# EAGLE schematic Motherboard (EAGLE 9.4.2)
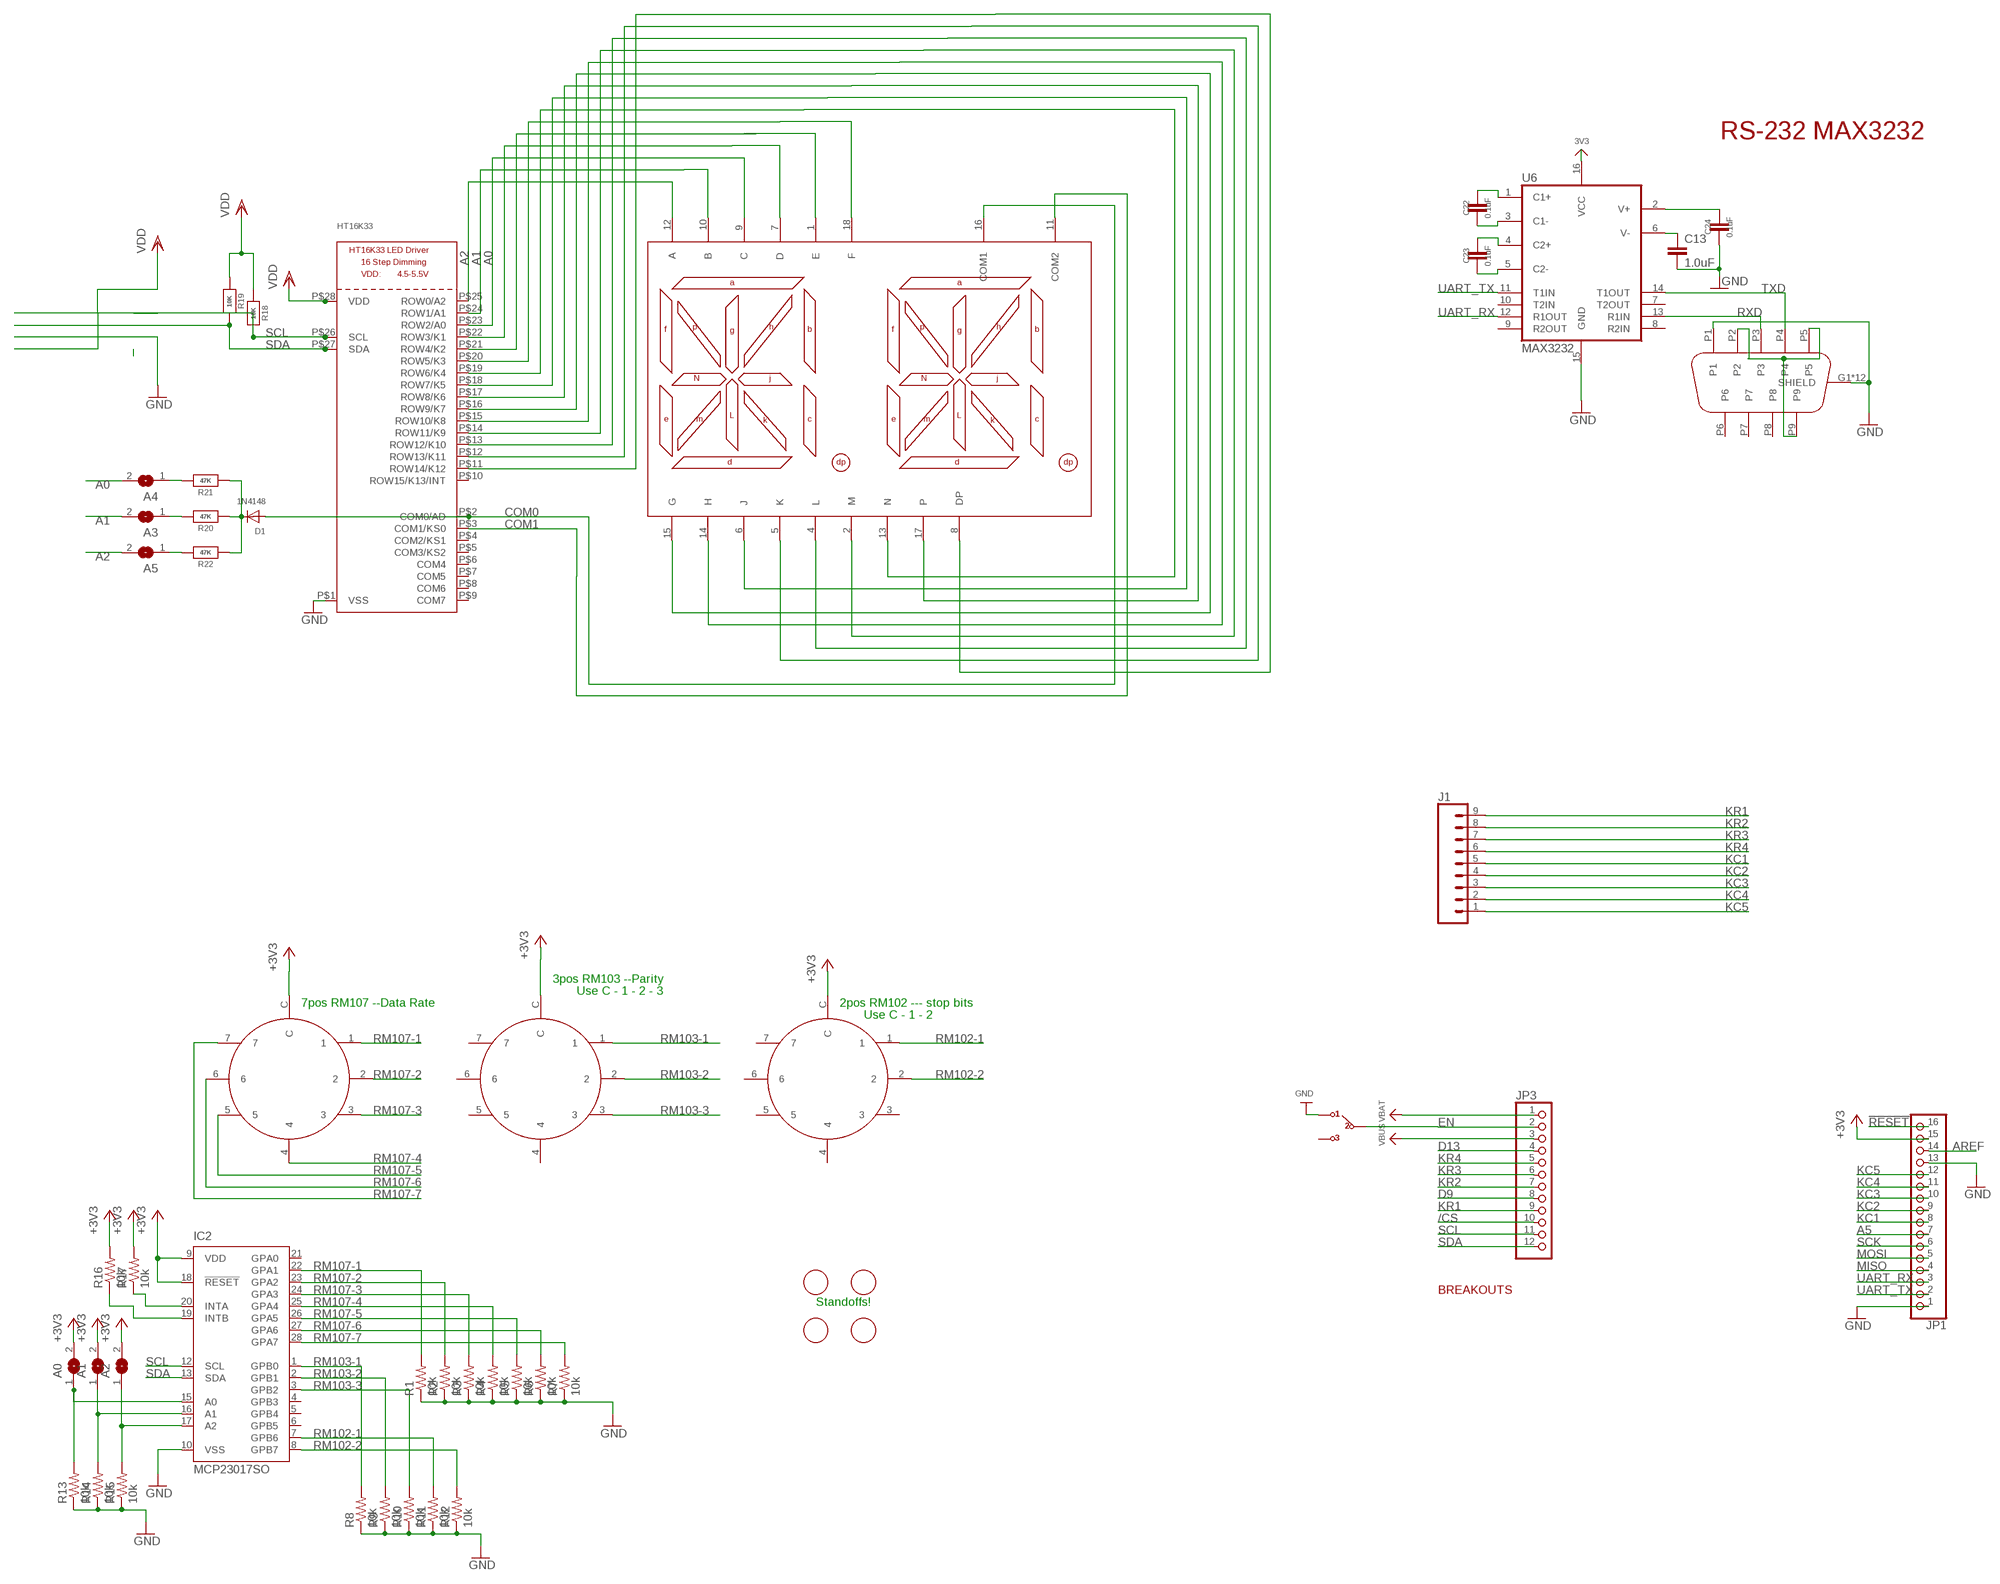
[diagram p0: schematic, sheet 1]

## Parts
A0  SJ  [SJ]
A1  SJ  [SJ]
A2  SJ  [SJ]
A3  SOLDERJUMPERREFLOW_NOPASTE  [SOLDERJUMPER_REFLOW_NOPASTE]
A4  SOLDERJUMPERREFLOW_NOPASTE  [SOLDERJUMPER_REFLOW_NOPASTE]
A5  SOLDERJUMPERREFLOW_NOPASTE  [SOLDERJUMPER_REFLOW_NOPASTE]
C13  1.0uF  1.0UF-0805-25V-10%  [0805]
C22  0.1uF  1.0UF-0805-25V-10%  [0805]
C23  0.1uF  1.0UF-0805-25V-10%  [0805]
C24  0.1uF  1.0UF-0805-25V-10%  [0805]
D1  1N4148  DIODESOD-323F  [SOD-323F]
DE9FEMALE  EDGEMOUNTDE9  [DE09S065TLF]
HT16K33  HT16K33_SOP28_SKINNY  [SOP28_300MIL_SKINNY]
IC2  MCP23017SO  [SO28W]
J1  CONN_09  [1X09]
JP1  HEADER-1X16ROUND  [1X16_ROUND]
JP3  HEADER-1X12  [1X12_ROUND]
R1  10k  R-US_M0805  [M0805]
R2  10k  R-US_M0805  [M0805]
R3  10k  R-US_M0805  [M0805]
R4  10k  R-US_M0805  [M0805]
R5  10k  R-US_M0805  [M0805]
R6  10k  R-US_M0805  [M0805]
R7  10k  R-US_M0805  [M0805]
R8  10k  R-US_M0805  [M0805]
R9  10k  R-US_M0805  [M0805]
R10  10k  R-US_M0805  [M0805]
R11  10k  R-US_M0805  [M0805]
R12  10k  R-US_M0805  [M0805]
R13  10k  R-US_M0805  [M0805]
R14  10k  R-US_M0805  [M0805]
R15  10k  R-US_M0805  [M0805]
R16  10k  R-US_M0805  [M0805]
R17  10k  R-US_M0805  [M0805]
R18  10K  RESISTOR0805_NOOUTLINE  [0805-NO]
R19  10K  RESISTOR0805_NOOUTLINE  [0805-NO]
R20  47K  RESISTOR0805_NOOUTLINE  [0805-NO]
R21  47K  RESISTOR0805_NOOUTLINE  [0805-NO]
R22  47K  RESISTOR0805_NOOUTLINE  [0805-NO]
U6  MAX3232  MAX2323SOIC16  [SO16]
U$1  HDSP-A27C  [DIP-18]
U$2  RM107772BCB  [RM107772BCB]
U$3  RM107772BCB  [RM107772BCB]
U$5  OS102011MA1QN1  [OS102011MA1QN1]
U$6  RM107772BCB  [RM107772BCB]
U$7  KEYSTONESTANDOFF  [KEYSTONESTANDOFF]
U$8  KEYSTONESTANDOFF  [KEYSTONESTANDOFF]
U$9  KEYSTONESTANDOFF  [KEYSTONESTANDOFF]
U$10  KEYSTONESTANDOFF  [KEYSTONESTANDOFF]

## Nets
3V3: U6.16(VCC)
!RESET: JP1.16
+3V3: A0.2 A1.2 A2.2 IC2.9(VDD) IC2.18(!RESET) JP1.15 R16.2 R17.2 U$2.C U$3.C U$6.C
/CS: JP3.10
A0: A4.2 HT16K33.P$23(ROW2/A0) U$1.9(C)
A1: A3.2 HT16K33.P$24(ROW1/A1) U$1.10(B)
A2: A5.2 HT16K33.P$25(ROW0/A2) U$1.12(A)
A5: JP1.7
AREF: JP1.14
COM0: D1.A HT16K33.P$2(COM0/AD) U$1.16(COM1)
COM1: HT16K33.P$3(COM1/KS0) U$1.11(COM2)
D9: JP3.8
D13: JP3.4
EN: JP3.2 U$5.P$2
GND: C13.2 C24.2 DE9FEMALE.G1(SHIELD) DE9FEMALE.G2(SHIELD) DE9FEMALE.G3(SHIELD) DE9FEMALE.G4(SHIELD) DE9FEMALE.G5(SHIELD) DE9FEMALE.G6(SHIELD) DE9FEMALE.G7(SHIELD) DE9FEMALE.G8(SHIELD) DE9FEMALE.G9(SHIELD) DE9FEMALE.G10(SHIELD) DE9FEMALE.G11(SHIELD) DE9FEMALE.G12(SHIELD) DE9FEMALE.P1 HT16K33.P$1(VSS) IC2.10(VSS) JP1.1 JP1.13 R1.1 R2.1 R3.1 R4.1 R5.1 R6.1 R7.1 R8.1 R9.1 R10.1 R11.1 R12.1 R13.1 R14.1 R15.1 U6.15(GND) U$5.P$1
KC1: J1.5 JP1.8
KC2: J1.4 JP1.9
KC3: J1.3 JP1.10
KC4: J1.2 JP1.11
KC5: J1.1 JP1.12
KR1: J1.9 JP3.9
KR2: J1.8 JP3.7
KR3: J1.7 JP3.6
KR4: J1.6 JP3.5
MISO: JP1.4
MOSI: JP1.5
N$1: A3.1 R20.2
N$2: A4.1 R21.2
N$3: HT16K33.P$22(ROW3/K1) U$1.7(D)
N$4: HT16K33.P$21(ROW4/K2) U$1.1(E)
N$5: HT16K33.P$20(ROW5/K3) U$1.18(F)
N$6: HT16K33.P$19(ROW6/K4) U$1.13(N)
N$7: HT16K33.P$18(ROW7/K5) U$1.6(J)
N$8: D1.C R20.1 R21.1 R22.1
N$9: A5.1 R22.2
N$10: HT16K33.P$17(ROW8/K6) U$1.17(P)
N$11: HT16K33.P$16(ROW9/K7) U$1.15(G)
N$12: HT16K33.P$15(ROW10/K8) U$1.14(H)
N$18: C22.2 U6.3(C1-)
N$19: C22.1 U6.1(C1+)
N$20: C23.1 U6.4(C2+)
N$21: C23.2 U6.5(C2-)
N$22: C24.1 U6.2(V+)
N$23: C13.1 U6.6(V-)
N$24: DE9FEMALE.P2 DE9FEMALE.P5 DE9FEMALE.P9
N$25: A0.1 IC2.15(A0) R13.2
N$26: A1.1 IC2.16(A1) R14.2
N$27: A2.1 IC2.17(A2) R15.2
N$28: IC2.19(INTB) R16.1
N$29: IC2.20(INTA) R17.1
N$32: HT16K33.P$14(ROW11/K9) U$1.2(M)
N$33: HT16K33.P$13(ROW12/K10) U$1.4(L)
N$34: HT16K33.P$12(ROW13/K11) U$1.5(K)
N$35: HT16K33.P$11(ROW14/K12) U$1.8(DP)
RM102-1: IC2.7(GPB6) R11.2 U$6.1
RM102-2: IC2.8(GPB7) R12.2 U$6.2
RM103-1: IC2.1(GPB0) R8.2 U$3.1
RM103-2: IC2.2(GPB1) R9.2 U$3.2
RM103-3: IC2.3(GPB2) R10.2 U$3.3
RM107-1: IC2.22(GPA1) R1.2 U$2.1
RM107-2: IC2.23(GPA2) R2.2 U$2.2
RM107-3: IC2.24(GPA3) R3.2 U$2.3
RM107-4: IC2.25(GPA4) R4.2 U$2.4
RM107-5: IC2.26(GPA5) R5.2 U$2.5
RM107-6: IC2.27(GPA6) R6.2 U$2.6
RM107-7: IC2.28(GPA7) R7.2 U$2.7
RXD: DE9FEMALE.P3 U6.13(R1IN)
SCK: JP1.6
SCL: HT16K33.P$26(SCL) IC2.12(SCL) JP3.11 R18.2
SDA: HT16K33.P$27(SDA) IC2.13(SDA) JP3.12 R19.2
TXD: DE9FEMALE.P4 U6.14(T1OUT)
UART_RX: JP1.3 U6.12(R1OUT)
UART_TX: JP1.2 U6.11(T1IN)
VBAT: JP3.1
VBUS: JP3.3
VDD: HT16K33.P$28(VDD) R18.1 R19.1
Unconnected: DE9FEMALE.P6 DE9FEMALE.P7 DE9FEMALE.P8 HT16K33.P$4(COM2/KS1) HT16K33.P$5(COM3/KS2) HT16K33.P$6(COM4) HT16K33.P$7(COM5) HT16K33.P$8(COM6) HT16K33.P$9(COM7) HT16K33.P$10(ROW15/K13/INT) IC2.4(GPB3) IC2.5(GPB4) IC2.6(GPB5) IC2.21(GPA0) U6.7(T2OUT) U6.8(R2IN) U6.9(R2OUT) U6.10(T2IN) U$3.4 U$3.5 U$3.6 U$3.7 U$5.CASE1(CASE) U$5.CASE2(CASE) U$5.P$3 U$6.3 U$6.4 U$6.5 U$6.6 U$6.7

## Notes on the sheet
- RS-232 MAX3232
- 3pos RM103 --Parity
- Use C - 1 - 2 - 3
- 7pos RM107 --Data Rate | 2pos RM102 --- stop bits
- Use C - 1 - 2
- BREAKOUTS
- Standoffs!

## Library data of the parts
A0 A1 A2 = jumper:SJ: SMD solder JUMPER
A3-A5 = microbuilder:SOLDERJUMPER: SMD Solder JUMPER Solder the two pads together to create a connection, or remove the solder to break it. REFLOW - Use this footprint for solder paste and reflow ovens. WAVE - Use this footprint for hand-soldering (larger pads). CLOSED - Has a trace between the two pads to ensure it is closed by default. The trace needs to be cut to disable the jumper, and can be closed again by creating a solder bridge between the two pads.
C13 = SparkFun-Capacitors:1.0UF: 1µF ceramic capacitors A capacitor is a passive two-terminal electrical component used to store electrical energy temporarily in an electric field.; PROD_ID: CAP-08064
C22-C24 = SparkFun-Capacitors:1.0UF: 1µF ceramic capacitors A capacitor is a passive two-terminal electrical component used to store electrical energy temporarily in an electric field.; PROD_ID: CAP-08064; VALUE: 1.0uF
D1 = adafruit:DIODE: Diode SMADIODE - SMA Surface Mount Package 20V 1A Schottky Diode Digikey: 641-1014-6-ND DO-1N4148 - Through Hole Small Current Diode SOD-123 20V 1 A (.5mV Vf) Schottky Diode - Digikey: MBRX120TPMSCT-ND SOD-323 10V 570mA (.38mV Vf, 3ns) Schottky Diode - Digikey: ZLLS410CT-ND SOD-523 30V 30mA Schottky Diode (RB751S-40TE61) - Digikey: RB751S-40TE61CT-ND SOT23-R/W - SOT23 Package (R = Solder Paste/Reflow Ovens, W = Hand-Soldering) BAT54Film 40V 300mA - Digikey: 497-7162-1-ND
DE9FEMALE = Serial:EDGEMOUNTDE9
HT16K33 = microbuilder:HT16K33_SOP28
IC2 = adafruit:MCP23017: http://ww1.microchip.com/downloads/en/DeviceDoc/21952a.pdf Source: http://ww1.microchip.com/downloads/en/DeviceDoc/21952a.pdf
J1 = SparkFun-Connectors:CONN_09: Multi connection point. Often used as Generic Header-pin footprint for 0.1 inch spaced/style header connections On any of the 0.1 inch spaced packages, you can populate with these: Break Away Headers - Straight <https://www.sparkfun.com/products/116> (PRT-00116) Break Away Male Headers - Right Angle <https://www.sparkfun.com/products/553> (PRT-00553) Female Headers <https://www.sparkfun.com/products/115> (PRT-00115) Break Away Headers - Machine Pin <https://www.sparkfun.com/products/117> (PRT-00117) Break Away Female Headers - Swiss Machine Pin <https://www.sparkfun.com/products/743> (PRT-00743) For SCREWTERMINALS and SPRING TERMINALS visit here: Screw Terimnals on SparkFun.com <https://www.sparkfun.com/search/results?term=Screw+Terminals> (5mm/3.5mm/2.54mm spacing) This device is also useful as a general connection point to wire up your design to another part of your project. Our various solder wires solder well into these plated through hole pads. Hook-Up Wire - Assortment (Stranded, 22 AWG) <https://www.sparkfun.com/products/11375> (PRT-11375) Hook-Up Wire - Assortment (Solid Core, 22 AWG) <https://www.sparkfun.com/products/11367> (PRT-11367) View the entire wire category on our website here <https://www.sparkfun.com/categories/141> Special notes: Molex polarized connector foot print use with SKU : PRT-08231 with associated crimp pins and housings. 1MM SMD Version SKU: PRT-10208 NOTES ON THE VARIANTS LOCK and LOCK_LONGPADS... This footprint was designed to help hold the alignment of a through-hole component (i.e. 6-pin header) while soldering it into place. You may notice that each hole has been shifted either up or down by 0.005 of an inch from it's more standard position (which is a perfectly straight line). This slight alteration caused the pins (the squares in the middle) to touch the edges of the holes. Because they are alternating, it causes a "brace" to hold the component in place. 0.005 has proven to be the perfect amount of "off-center" position when using our standard breakaway headers. Although looks a little odd when you look at the bare footprint, once you have a header in there, the alteration is very hard to notice. Also,if you push a header all the way into place, it is covered up entirely on the bottom side.
JP1 = microbuilder:HEADER-1X16: PIN HEADER
JP3 = microbuilder:HEADER-1X12
R1-R17 = resistor:R-US_: RESISTOR, American symbol
R18-R22 = microbuilder:RESISTOR: Resistors For new designs, use the packages preceded by an '_' character since they are more reliable: The following footprints should be used on most boards: _0402 - Standard footprint for regular board layouts _0603 - Standard footprint for regular board layouts _0805 - Standard footprint for regular board layouts _1206 - Standard footprint for regular board layouts For extremely tight-pitch boards where space is at a premium, the following 'micro-pitch' footprints can be used (smaller pads, no silkscreen outline, etc.): _0402MP - Micro-pitch footprint for very dense/compact boards _0603MP - Micro-pitch footprint for very dense/compact boards _0805MP - Micro-pitch footprint for very dense/compact boards _1206MP - Micro-pitch footprint for very dense/compact boards
U6 = SparkFun-IC-Comms:MAX2323: RS232 Transceiver This part covers 232 drivers that are compatible with the MAX3232. Sipex SP3232EB Datasheet <http://cdn.sparkfun.com/datasheets/Components/General%20IC/SP3232EBCA-L.pdf> SparkFun Products SOIC component <https://www.sparkfun.com/products/589> (COM-00589 / IC-08171) Retired DIP component (COM-00316 / IC-08446) SparkFun Transceiver Breakout - MAX3232 <https://www.sparkfun.com/products/11189> (BOB-11189) SparkFun XBee Explorer Serial <https://www.sparkfun.com/products/13225> (WRL-13225); PROD_ID: IC-08171
U$1 = Segment displays:HDSP-A27C
U$2 U$3 U$6 = Segment displays:RM107772BCB
U$5 = FPC:OS102011MA1QN1
U$7-U$10 = Segment displays:KEYSTONESTANDOFF